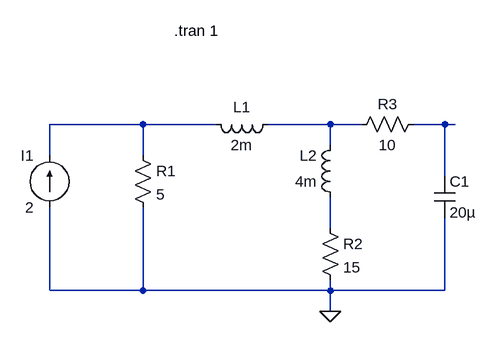
[diagram p0: schematic Draft2.asc]
Draft2.asc, the LTspice schematic file:
Version 4
SHEET 1 880 680
WIRE 304 240 160 240
WIRE 416 240 304 240
WIRE 592 240 496 240
WIRE 640 240 592 240
WIRE 768 240 720 240
WIRE 784 240 768 240
WIRE 592 272 592 240
WIRE 160 288 160 240
WIRE 304 288 304 240
WIRE 768 320 768 240
WIRE 592 400 592 352
WIRE 160 496 160 368
WIRE 304 496 304 368
WIRE 304 496 160 496
WIRE 592 496 592 480
WIRE 592 496 304 496
WIRE 768 496 768 384
WIRE 768 496 592 496
WIRE 592 528 592 496
FLAG 592 528 0
SYMBOL current 160 368 R180
WINDOW 0 24 80 Left 2
WINDOW 3 24 0 Left 2
SYMATTR InstName I1
SYMATTR Value 2
SYMBOL Res 288 272 R0
SYMATTR InstName R1
SYMATTR Value 5
SYMBOL ind 512 224 R90
WINDOW 0 5 56 VBottom 2
WINDOW 3 32 56 VTop 2
SYMATTR InstName L1
SYMATTR Value 2m
SYMBOL ind 608 368 R180
WINDOW 0 36 80 Left 2
WINDOW 3 36 40 Left 2
SYMATTR InstName L2
SYMATTR Value 4m
SYMBOL Res 576 384 R0
SYMATTR InstName R2
SYMATTR Value 15
SYMBOL Cap 752 320 R0
SYMATTR InstName C1
SYMATTR Value 20µ
SYMBOL Res 736 224 R90
WINDOW 0 0 56 VBottom 2
WINDOW 3 32 56 VTop 2
SYMATTR InstName R3
SYMATTR Value 10
TEXT 352 96 Left 2 !.tran 1

The netlist it stands for:
* Draft2.asc
I1 0 N001 2
R1 N001 0 5
L1 N002 N001 2m
L2 N004 N002 4m
R2 N004 0 15
C1 N003 0 20µ
R3 N003 N002 10
.tran 1
.backanno
.end